# Altium schematic sheet Keypad.SchDoc
size B
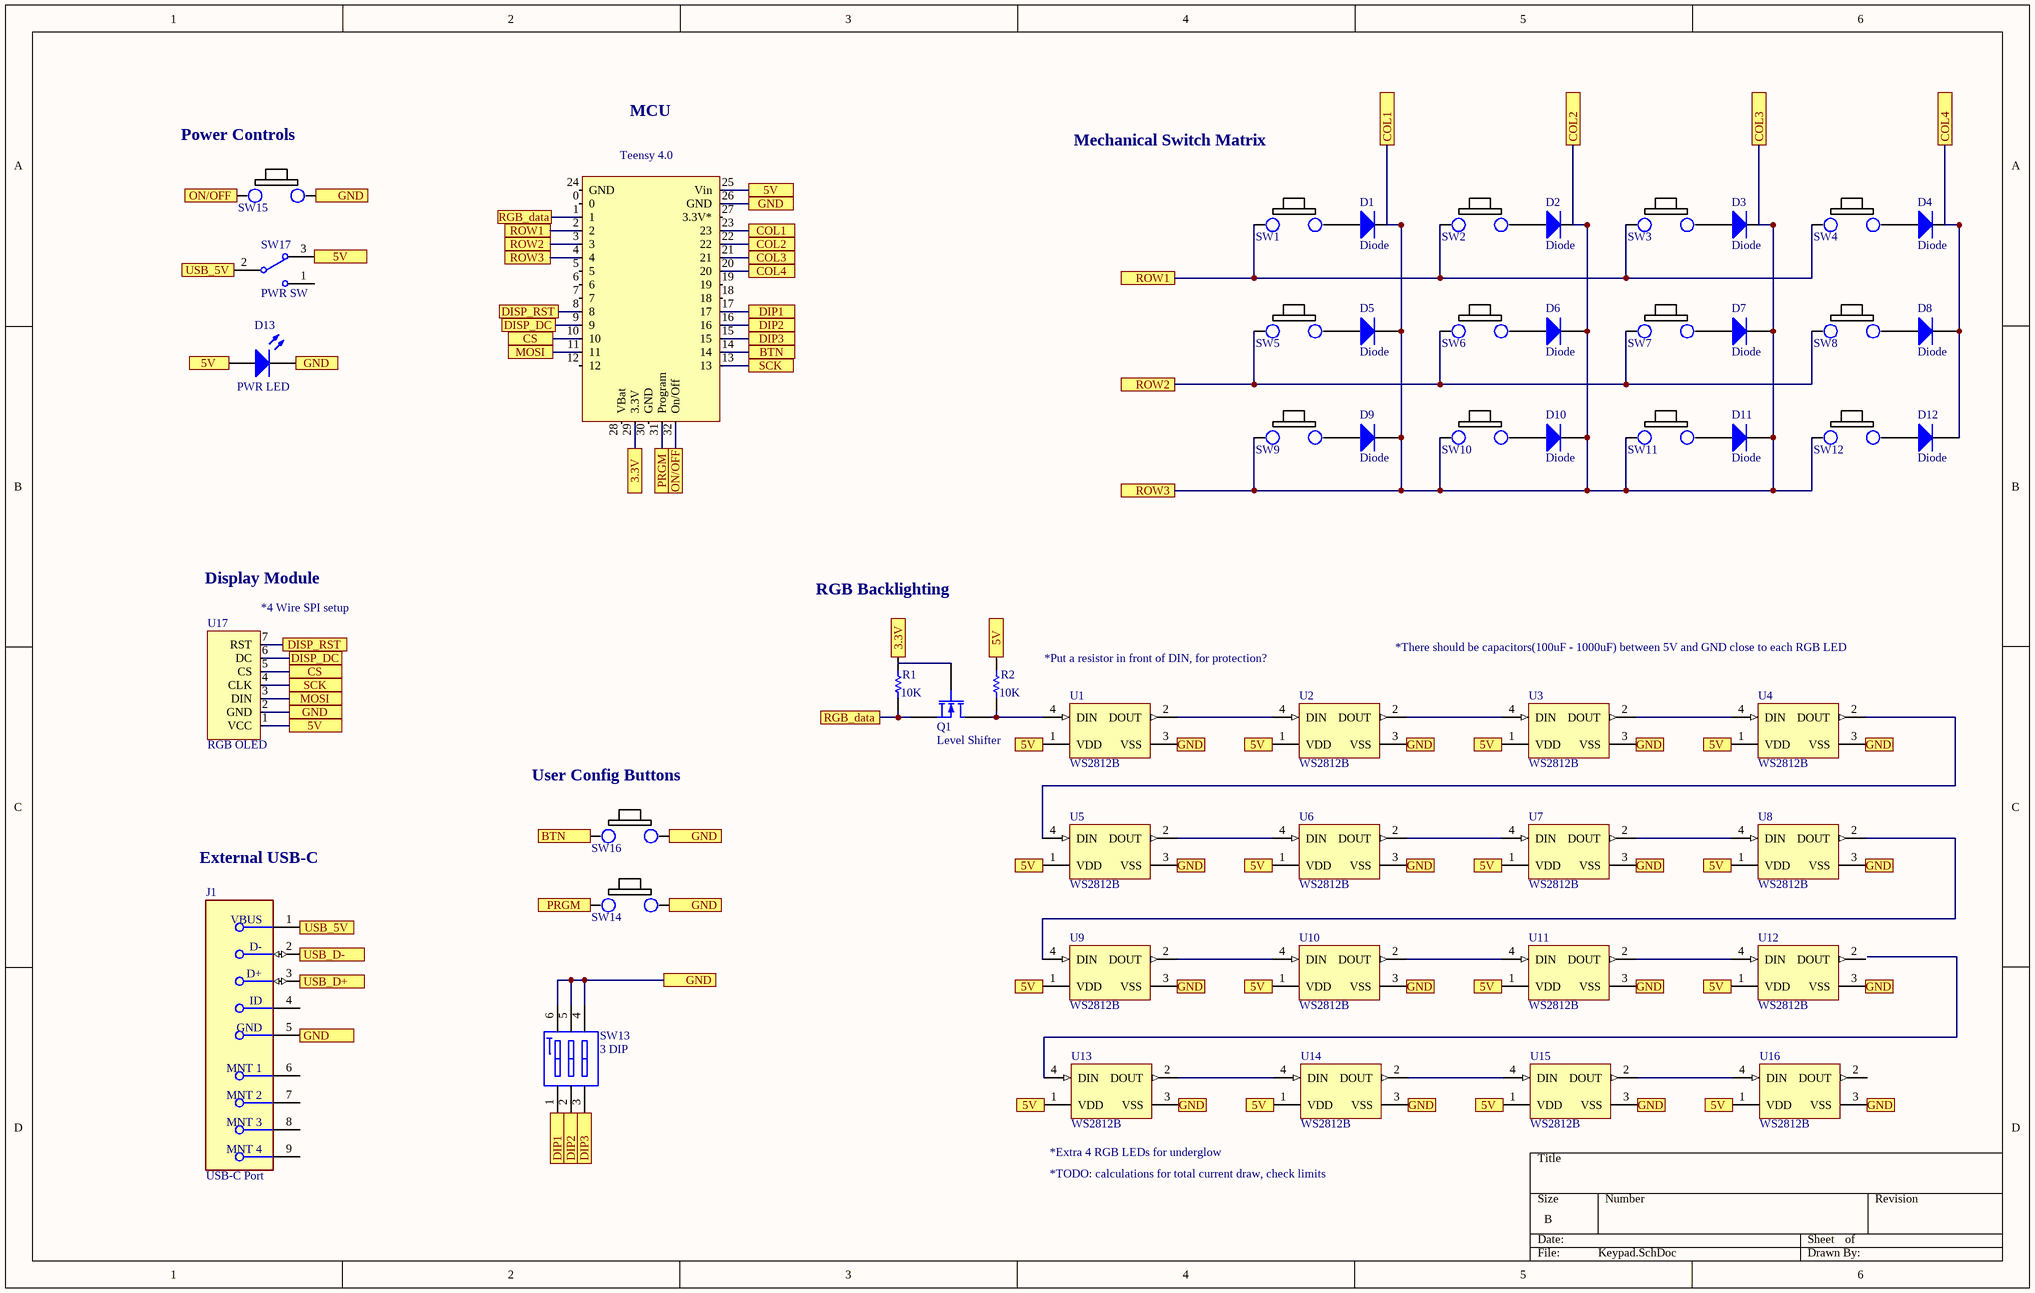
[diagram p0: Keypad.SchDoc]

## Parts
D1  Diode  [SMC]
D2  Diode  [SMC]
D3  Diode  [SMC]
D4  Diode  [SMC]
D5  Diode  [SMC]
D6  Diode  [SMC]
D7  Diode  [SMC]
D8  Diode  [SMC]
D9  Diode  [SMC]
D10  Diode  [SMC]
D11  Diode  [SMC]
D12  Diode  [SMC]
D13  PWR LED  [LED-0]
J1  USB-C Port  [FP-678038020-MFG]
Q1  Level Shifter  [E3]
R1  value 10K  [AXIAL-0.3]  (hidden comment: Res1)
R2  value 10K  [AXIAL-0.3]  (hidden comment: Res1)
SW1  SW?  (value not drawn)
SW2  SW?  (value not drawn)
SW3  SW?  (value not drawn)
SW4  SW?  (value not drawn)
SW5  SW?  (value not drawn)
SW6  SW?  (value not drawn)
SW7  SW?  (value not drawn)
SW8  SW?  (value not drawn)
SW9  SW?  (value not drawn)
SW10  SW?  (value not drawn)
SW11  SW?  (value not drawn)
SW12  SW?  (value not drawn)
SW13  3 DIP  [418121160803]
SW14  SW?  (value not drawn)
SW15  SW?  (value not drawn)
SW16  SW?  (value not drawn)
SW17  PWR SW  [TL36WW15050]
Teensy4  Teensy 4  (value not drawn)
U1  WS2812B  [ADA-RGB-1655_V]
U2  WS2812B  [ADA-RGB-1655_V]
U3  WS2812B  [ADA-RGB-1655_V]
U4  WS2812B  [ADA-RGB-1655_V]
U5  WS2812B  [ADA-RGB-1655_V]
U6  WS2812B  [ADA-RGB-1655_V]
U7  WS2812B  [ADA-RGB-1655_V]
U8  WS2812B  [ADA-RGB-1655_V]
U9  WS2812B  [ADA-RGB-1655_V]
U10  WS2812B  [ADA-RGB-1655_V]
U11  WS2812B  [ADA-RGB-1655_V]
U12  WS2812B  [ADA-RGB-1655_V]
U13  WS2812B  [ADA-RGB-1655_V]
U14  WS2812B  [ADA-RGB-1655_V]
U15  WS2812B  [ADA-RGB-1655_V]
U16  WS2812B  [ADA-RGB-1655_V]
U17  RGB OLED

## Ports
3.3V, 5V, BTN, COL1, COL2, COL3, COL4, CS, DIP1, DIP2, DIP3, DISP_DC, DISP_RST, GND, MOSI, ON/OFF, PRGM, RGB_data, ROW1, ROW2, ROW3, SCK, USB_5V, USB_D+, USB_D-

## Nets
3.3V: R1.2 Teensy4.29(3.3V) ; port 3.3V
5V: D13.1(A) R2.2 SW17.3 Teensy4.25(Vin) U1.1(VDD) U2.1(VDD) U3.1(VDD) U4.1(VDD) U5.1(VDD) U6.1(VDD) U7.1(VDD) U8.1(VDD) U9.1(VDD) U10.1(VDD) U11.1(VDD) U12.1(VDD) U13.1(VDD) U14.1(VDD) U15.1(VDD) U16.1(VDD) U17.1(VCC) ; port 5V
BTN: SW16.11 Teensy4.14 ; port BTN
COL1: D1.2(K) D2.2(K) D3.2(K) D5.2(K) D6.2(K) D7.2(K) D9.2(K) D10.2(K) D11.2(K) SW9.11 SW10.11 SW11.11 SW12.11 Teensy4.4 Teensy4.21 Teensy4.22 Teensy4.23 ; port ROW3, port COL1, port COL2, port COL3
COL4: D4.2(K) D8.2(K) D12.2(K) Teensy4.20 ; port COL4
CS: Teensy4.10 U17.5(CS) ; port CS
DIP1: SW13.1 Teensy4.17 ; port DIP1
DIP2: SW13.2 Teensy4.16 ; port DIP2
DIP3: SW13.3 Teensy4.15 ; port DIP3
DISP_DC: Teensy4.9 U17.6(DC) ; port DISP_DC
DISP_RST: Teensy4.8 U17.7(RST) ; port DISP_RST
GND: D13.2(K) J1.5(GND) SW13.4 SW13.5 SW13.6 SW14.10 SW15.10 SW16.10 Teensy4.26(GND) U1.3(VSS) U2.3(VSS) U3.3(VSS) U4.3(VSS) U5.3(VSS) U6.3(VSS) U7.3(VSS) U8.3(VSS) U9.3(VSS) U10.3(VSS) U11.3(VSS) U12.3(VSS) U13.3(VSS) U14.3(VSS) U15.3(VSS) U16.3(VSS) U17.2(GND) ; port GND
MOSI: Teensy4.11 U17.3(DIN) ; port MOSI
ON/OFF: SW15.11 Teensy4.32(On/Off) ; port ON/OFF
PRGM: SW14.11 Teensy4.31(Program) ; port PRGM
RGB_data: Q1.3(S) R1.1 Teensy4.1 ; port RGB_data
ROW1: SW1.11 SW2.11 SW3.11 SW4.11 Teensy4.2 ; port ROW1
ROW2: SW5.11 SW6.11 SW7.11 SW8.11 Teensy4.3 ; port ROW2
SCK: Teensy4.13 U17.4(CLK) ; port SCK
USB_5V: J1.1(VBUS) SW17.2 ; port USB_5V
USB_D+: J1.3(D+) ; port USB_D+
USB_D-: J1.2(D-) ; port USB_D-
NetD1_1: D1.1(A) SW1.10
NetD2_1: D2.1(A) SW2.10
NetD3_1: D3.1(A) SW3.10
NetD4_1: D4.1(A) SW4.10
NetD5_1: D5.1(A) SW5.10
NetD6_1: D6.1(A) SW6.10
NetD7_1: D7.1(A) SW7.10
NetD8_1: D8.1(A) SW8.10
NetD9_1: D9.1(A) SW9.10
NetD10_1: D10.1(A) SW10.10
NetD11_1: D11.1(A) SW11.10
NetD12_1: D12.1(A) SW12.10
NetQ1_1: Q1.1(D) R2.1 U1.4(DIN)
NetU1_2: U1.2(DOUT) U2.4(DIN)
NetU2_2: U2.2(DOUT) U3.4(DIN)
NetU3_2: U3.2(DOUT) U4.4(DIN)
NetU4_2: U4.2(DOUT) U5.4(DIN)
NetU5_2: U5.2(DOUT) U6.4(DIN)
NetU6_2: U6.2(DOUT) U7.4(DIN)
NetU7_2: U7.2(DOUT) U8.4(DIN)
NetU8_2: U8.2(DOUT) U9.4(DIN)
NetU9_2: U9.2(DOUT) U10.4(DIN)
NetU10_2: U10.2(DOUT) U11.4(DIN)
NetU11_2: U11.2(DOUT) U12.4(DIN)
NetU13_2: U13.2(DOUT) U14.4(DIN)
NetU14_2: U14.2(DOUT) U15.4(DIN)
NetU15_2: U15.2(DOUT) U16.4(DIN)

Not connected (* = marked no-connect by the designer): J1 4(ID) 6(MNT_1) 7(MNT_2) 8(MNT_3) 9(MNT_4); Q1 2(G); SW17 1; Teensy4 0 5 6 7 12 18 19 24(GND) 27(3.3V*) 28(VBat) 30(GND); U12 2(DOUT); U13 4(DIN); U16 2(DOUT)

## Notes on the sheet
- (near SW15) Power Controls
- MCU
- Mechanical Switch Matrix
- Display Module
- (near U17) *4 Wire SPI setup
- RGB Backlighting
- *Put a resistor in front of DIN, for protection?
- *There should be capacitors(100uF - 1000uF) between 5V and GND close to each RGB LED
- (near SW16) User Config Buttons
- External USB-C
- (near U13) *Extra 4 RGB LEDs for underglow
- *TODO: calculations for total current draw, check limits
- (in symbol Teensy4) Teensy 4.0

## Library data of the parts
D1-D12 = Diode: Default Diode; Published: 8-Jun-2000; LatestRevisionDate: 17-Jul-2002; LatestRevisionNote: Re-released for DXP Platform.; PackageVersion: Sep-1996; PackageReference: SMC; Publisher: Altium Limited; PackageDescription: DO-214-AB/SMC; 2 C-Bend Leads; Body 7.9 x 5.9 mm, inc. leads (LxW); Code_JEDEC: DO-214-AB
D13 = LED0: Typical INFRARED GaAs LED; Published: 8-Jun-2000; LatestRevisionDate: 08-Jul-2005; LatestRevisionNote: Mech Layer 1 removed.; PackageReference: LED-0; Publisher: Altium Limited; PackageDescription: LED; 2 Leads
J1 = CMP-04767-000002-1: CONN RCPT USB2.0 MINI AB SMD R/A; Manufacturer Part Number: 678038020; Manufacturer: Molex; Is Female: yes; Pitch: 0.8mm; Number Of Contacts: 5; Conn Orientation: Right Angle; Voltage Rating: 30V; Shielding: true; Current Rating: 1A; Octopart: https://octopart.com/67803-8020-molex-7136109; ComponentLink2Description: Datasheet; Lead Free: Yes; Temperature Range Low: 0°C; Temperature: 0°C to +50°C; Usb Standard: USB 2.0; Device Class L2: USB Connectors; Device Class L3: unset; Category: Conn; Temperature Range High: +50°C; Mouser Description: Conn Mini-USB Type AB RCP 5 POS 0.8mm Solder RA SMD 5 Terminal 1 Port Embossed T/R; Device Class L1: Connectors; Ambient Temperature Range Low: 0°C; Contact Material: Gold,Nickel; Ambient Temperature Range High: +50°C; Height: 4.1mm; Package: 0; RoHS: TRUE; Digikey Description: CONN RCPT USB2.0 MINI AB SMD R/A; Automotive: No; Footprint Url: https://www.molex.com/pdm_docs/sd/678038020_sd.pdf; ComponentLink2URL: https://www.molex.com/webdocs/datasheets/pdf/en-us/0678038020_IO_CONNECTORS.pdf
Q1 = MOSFET-N: N-Channel MOSFET; Published: 8-Jun-2000; LatestRevisionDate: 17-Jul-2002; LatestRevisionNote: Re-released for DXP Platform.; PackageVersion: 1995/1996; PackageReference: E3; Publisher: Altium Limited; PackageDescription: TO, Flat Index; 3 In-Line, Axial Leads; Body Dia. 4.6mm; Lead Dia. 0.5 mm (max)
R1 R2 = Res1: Resistor; Published: 8-Jun-2000; LatestRevisionDate: 17-Jul-2002; LatestRevisionNote: Re-released for DXP Platform.; PackageReference: AXIAL-0.3; Publisher: Altium Limited; PackageDescription: Axial Device, Thru-Hole; 2 Leads; 0.3 in Pin Spacing
SW13 = CMP-1437-00003-1: WS-DISV 2.54 mm small compact SMD Dip Switch with top tape; Manufacturer: Wuerth Elektronik; NoPins: 06; ComponentLink1Description: Manufacturer URL; ComponentLink2Description: Datasheet; PartNumber: 418121160803; ComponentLink1URL: http://www.we-online.com; ComponentLink2URL: http://katalog.we-online.de/em/datasheet/4181211608xx.pdf; PackageReference: 418121160803
SW17 = SW-SPDT: SPDT Subminiature Toggle Switch, Right Angle Mounting, Vertical Actuation; Published: 24-Mar-1999; LatestRevisionDate: 17-Dec-2003; LatestRevisionNote: Schematic revised, PCB Footprint replaced.; DatasheetVersion: 05-Dec-2000; PackageReference: TL36WW15050; Publisher: Altium Limited; PackageDescription: Switch; 4 Leads; ComponentLink1Description: Manufacturer Link; ComponentLink1URL: http://www.apem.com
Teensy4 = Teensy4: Parameter 1: TEST
U1-U16 = CMP-2000-05026-1: Intelligent Control LED Integrated Light Source, 3.5 to 5.3 V, -25 to 80 degC, 4-Pin SMD, RoHS, Tape and Reel; Manufacturer: Adafruit-Industries-LLC; Number of LEDs: 10; Configuration: Discrete; Utilized LED: WS2812(5050); Datasheet URL: http://datasheet.octopart.com/ADA1655-Adafruit-Industries-datasheet-32028139.pdf; Series: Neopixel; Interface: -; Package Description: 4-Pin Surface Mount Device, Body 5 x 5 mm; Color: Red,Green,Blue(RGB); Category: Optoelectronics; Controller Type: -; Package Reference: 1655; Manufacturer URL: https://www.adafruit.com/; Mounting Type: SurfaceMount; Datasheet Version: May-13; Size / Dimension: 5.00mmLx5.00mmW; Family: Addressable,Specialty
U17 = Waveshare_OLED_RGB